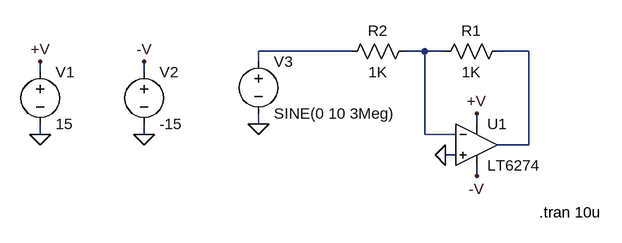
[diagram p0: schematic 6274.asc]
6274.asc, the LTspice schematic file:
Version 4
SHEET 1 880 680
WIRE 144 -112 0 -112
WIRE 256 -112 224 -112
WIRE 288 -112 256 -112
WIRE 416 -112 368 -112
WIRE 0 -96 0 -112
WIRE -336 -80 -336 -96
WIRE -176 -80 -176 -96
WIRE 0 0 0 -16
WIRE 336 0 336 -16
WIRE -336 16 -336 0
WIRE -176 16 -176 0
WIRE 256 16 256 -112
WIRE 304 16 256 16
WIRE 416 32 416 -112
WIRE 416 32 368 32
WIRE 304 48 288 48
WIRE 336 80 336 64
FLAG -336 16 0
FLAG -176 16 0
FLAG -336 -96 +V
FLAG -176 -96 -V
FLAG 336 -16 +V
FLAG 336 80 -V
FLAG 0 0 0
FLAG 288 48 0
SYMBOL voltage -336 -96 R0
SYMATTR InstName V1
SYMATTR Value 15
SYMBOL voltage -176 -96 R0
SYMATTR InstName V2
SYMATTR Value -15
SYMBOL res 384 -128 R90
WINDOW 0 0 56 VBottom 2
WINDOW 3 32 56 VTop 2
SYMATTR InstName R1
SYMATTR Value 1K
SYMBOL voltage 0 -112 R0
WINDOW 123 0 0 Left 2
WINDOW 39 0 0 Left 2
SYMATTR InstName V3
SYMATTR Value SINE(0 10 3Meg)
SYMBOL res 240 -128 R90
WINDOW 0 0 56 VBottom 2
WINDOW 3 32 56 VTop 2
SYMATTR InstName R2
SYMATTR Value 1K
SYMBOL opamps\\LT6274 336 32 R0
SYMATTR InstName U1
TEXT 432 136 Left 2 !.tran 10u

The netlist it stands for:
* 6274.asc
V1 +V 0 15
V2 -V 0 -15
R1 N003 N002 1K
V3 N001 0 SINE(0 10 3Meg)
R2 N002 N001 1K
* U1: LT6274 (symbol opamps\LT6274 not available, pins judged from their places): In+=0 In-=N002 V+=+V V-=-V OUT=N003
.tran 10u
.backanno
.end